# Altium schematic sheet 0188_PECI CONNECTIONS.SchDoc
size 848 x 558 mm
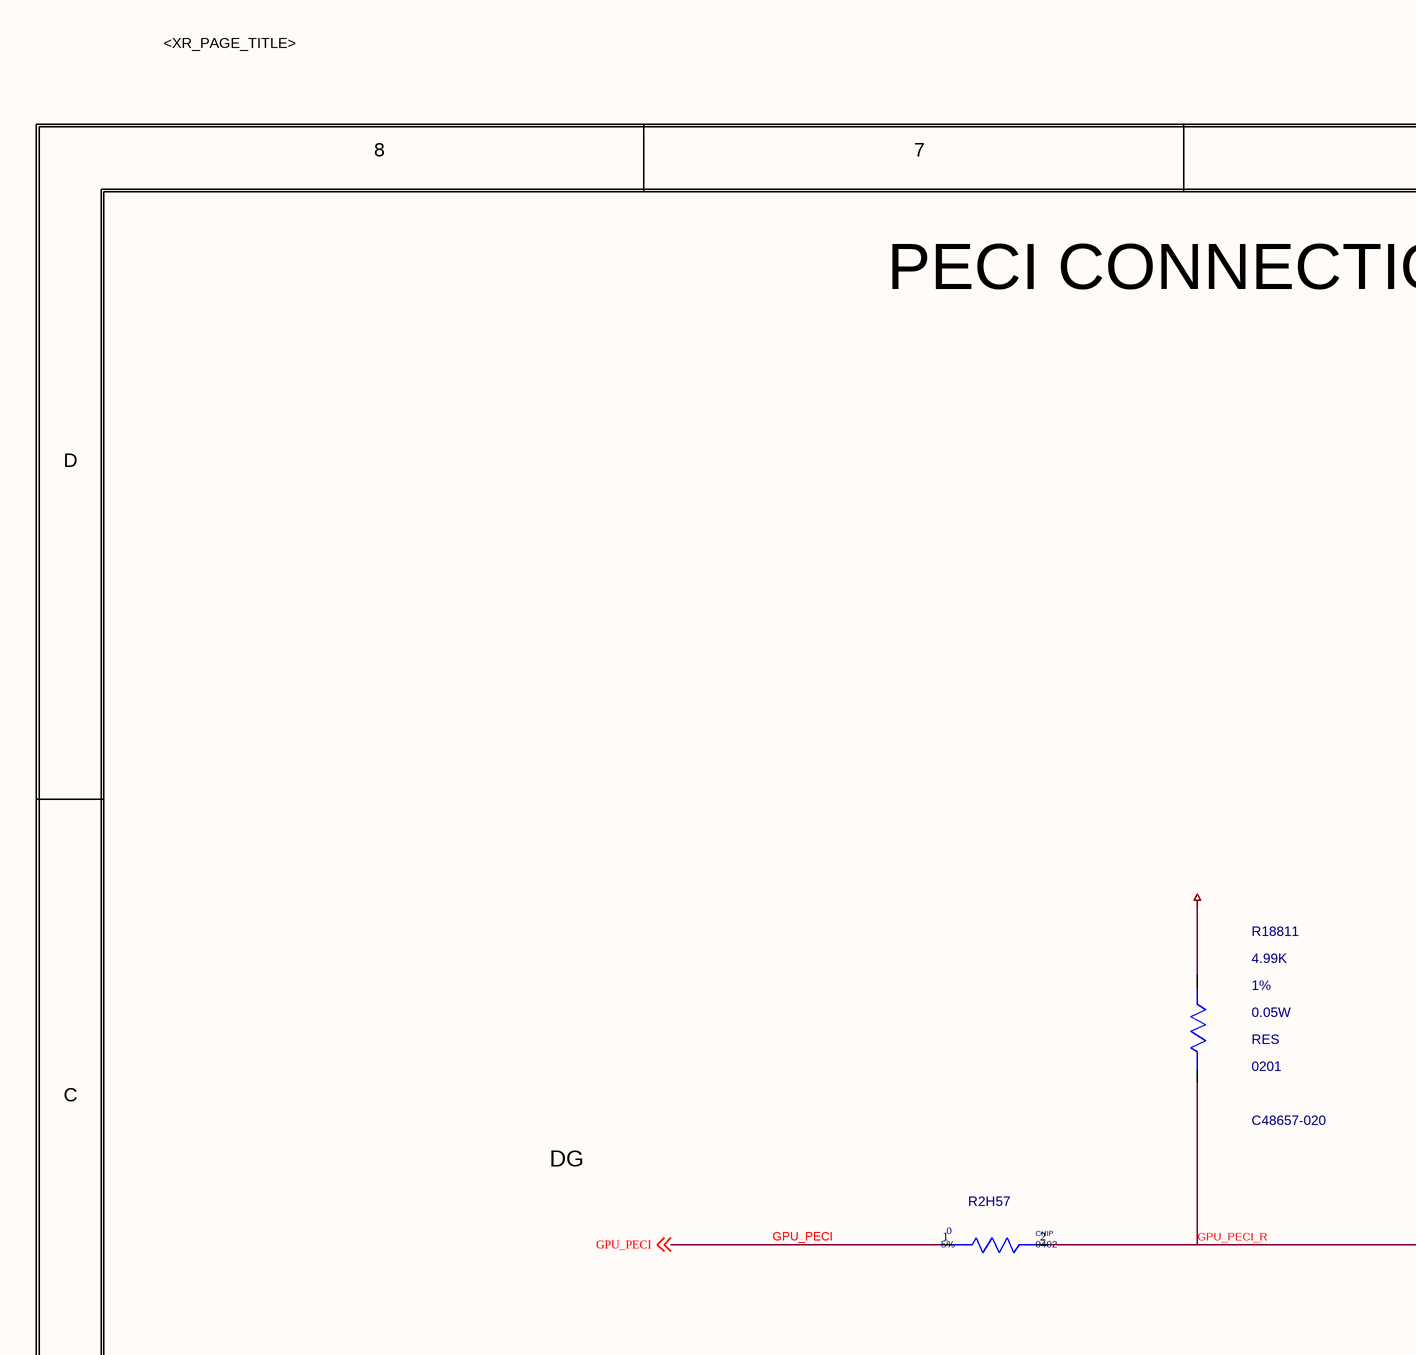
[diagram p0: 0188_PECI CONNECTIONS.SchDoc, top left]
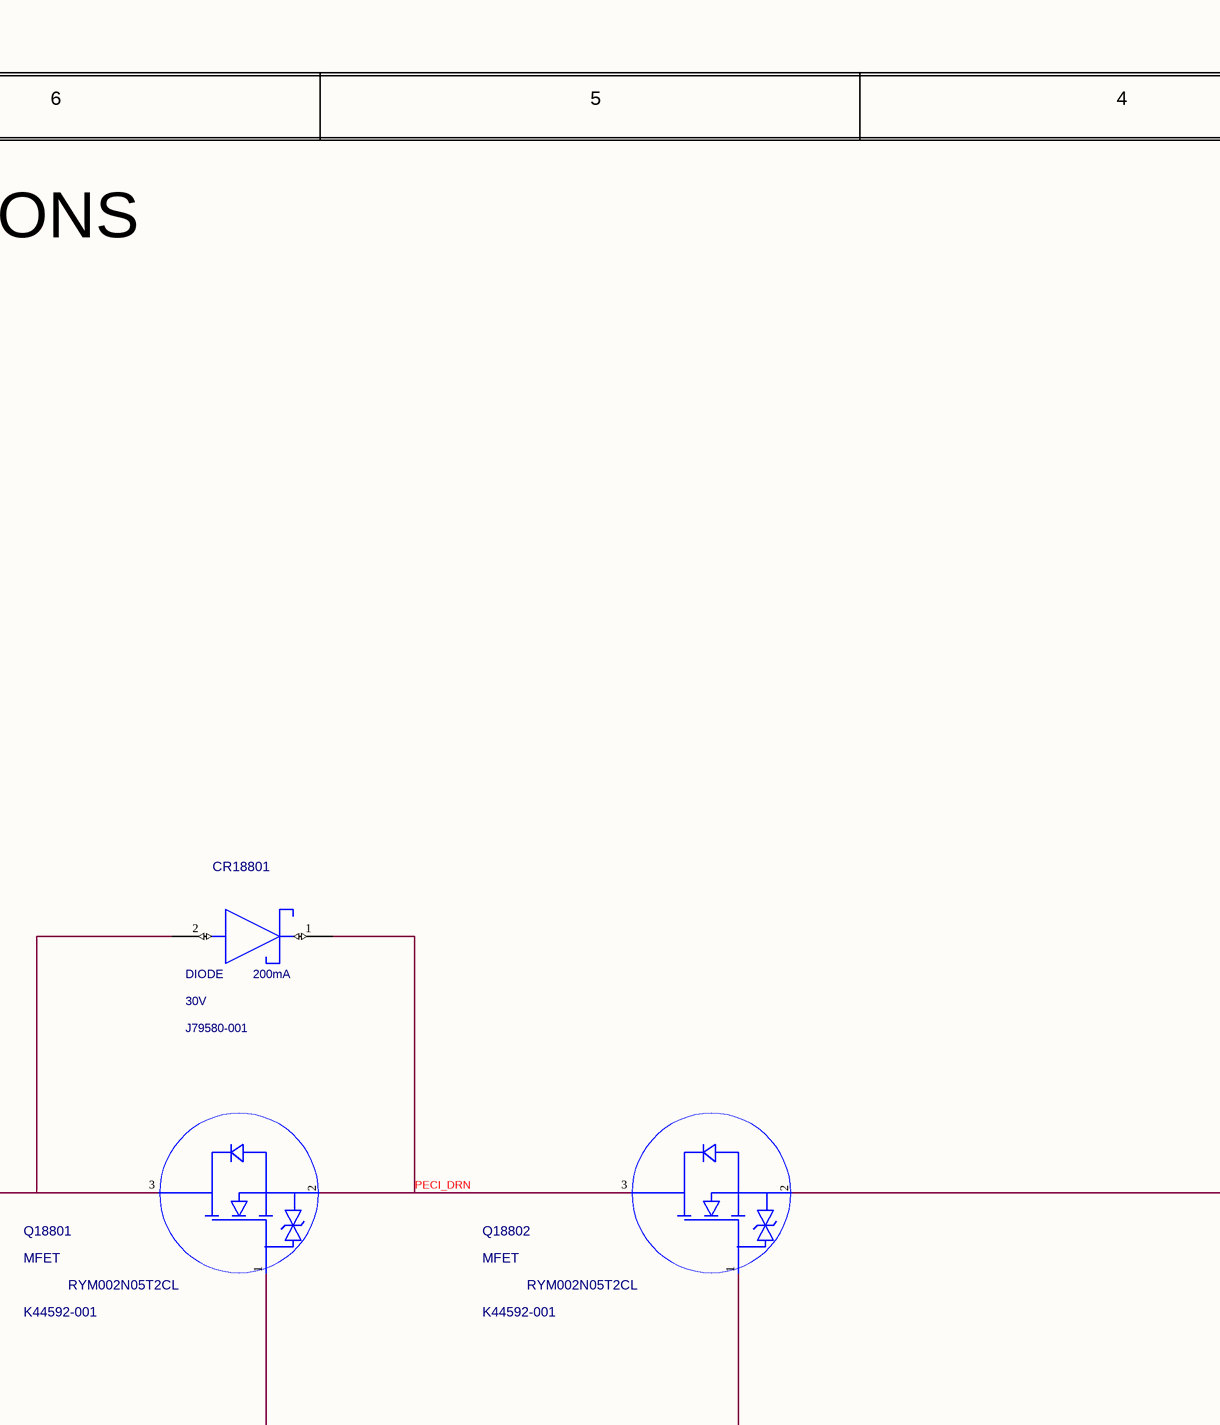
[diagram p1: 0188_PECI CONNECTIONS.SchDoc, top middle]
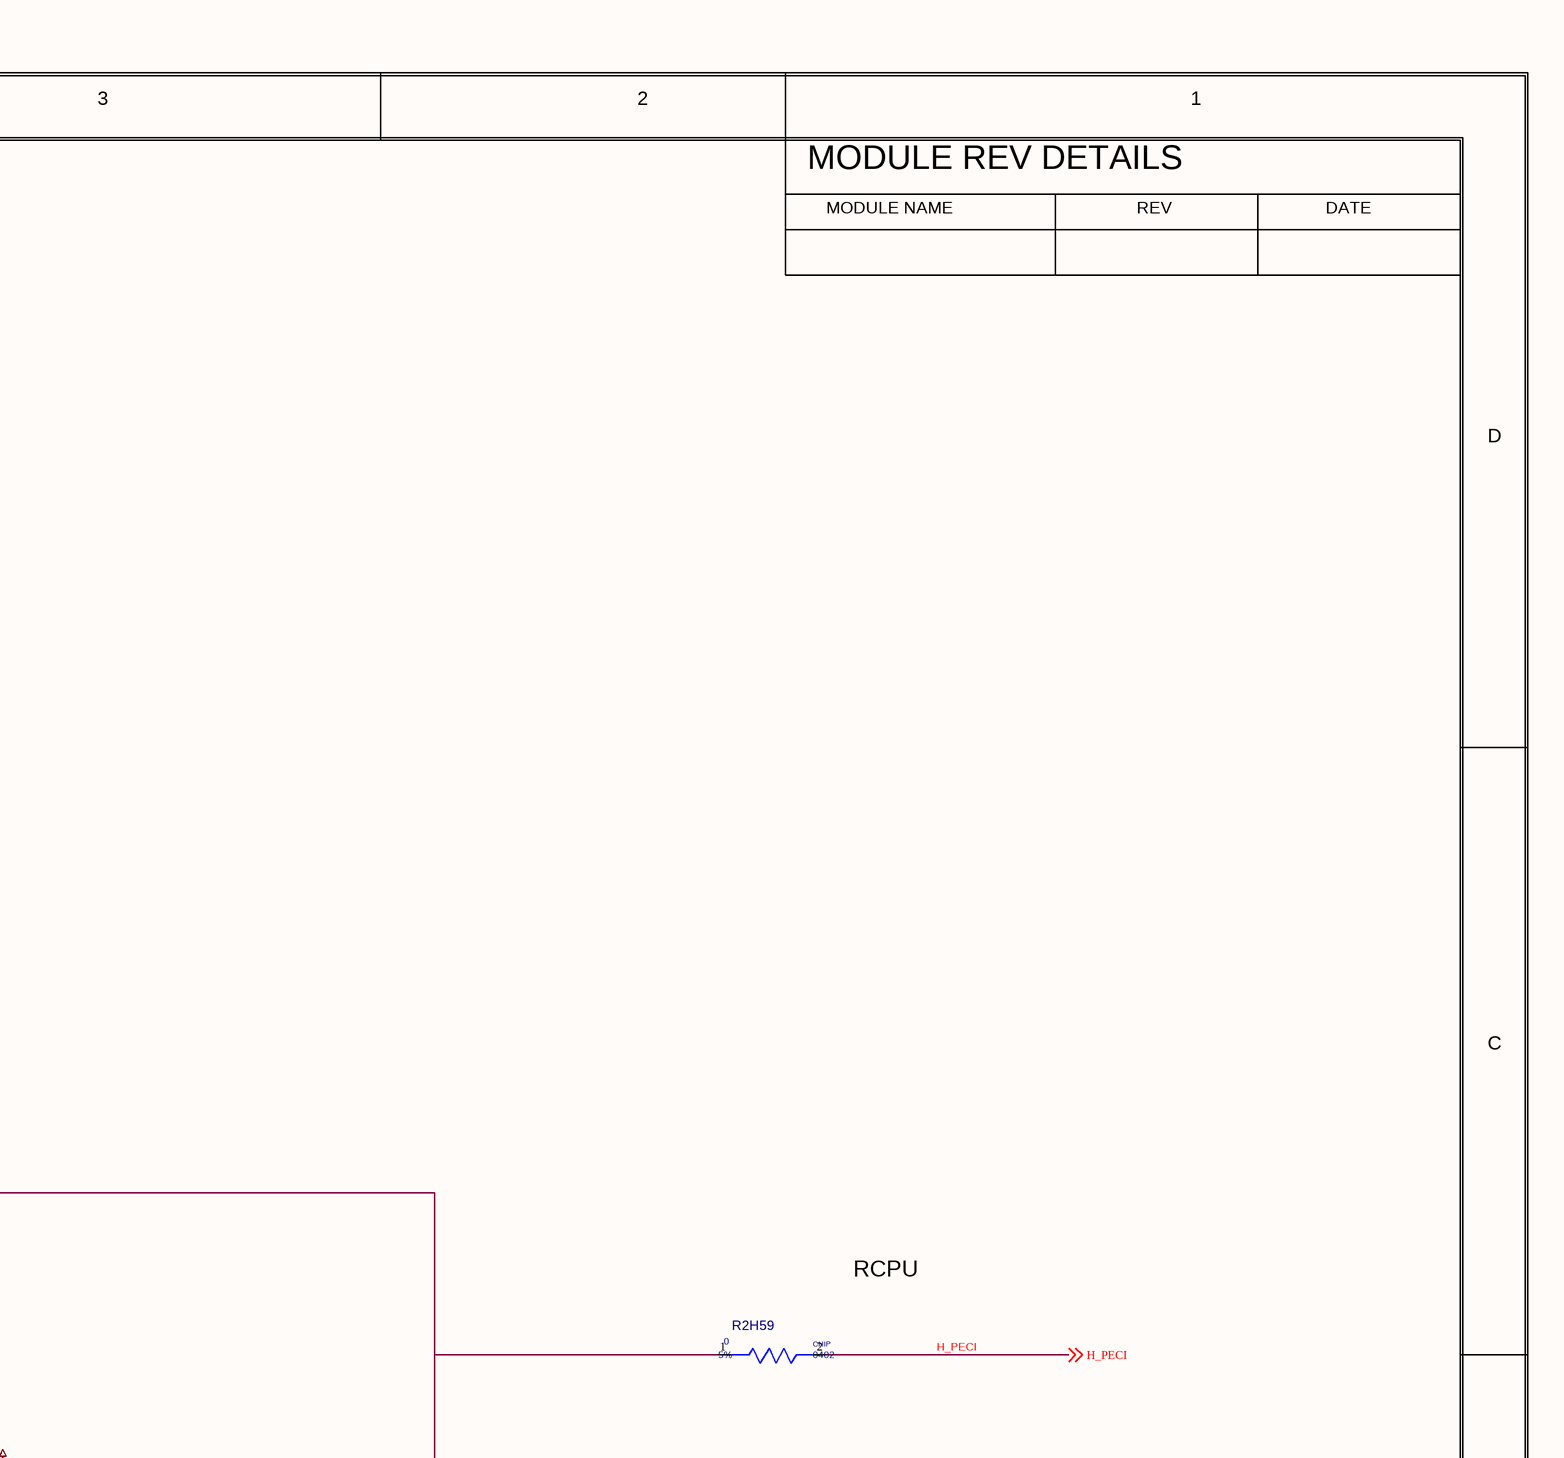
[diagram p2: 0188_PECI CONNECTIONS.SchDoc, top right]
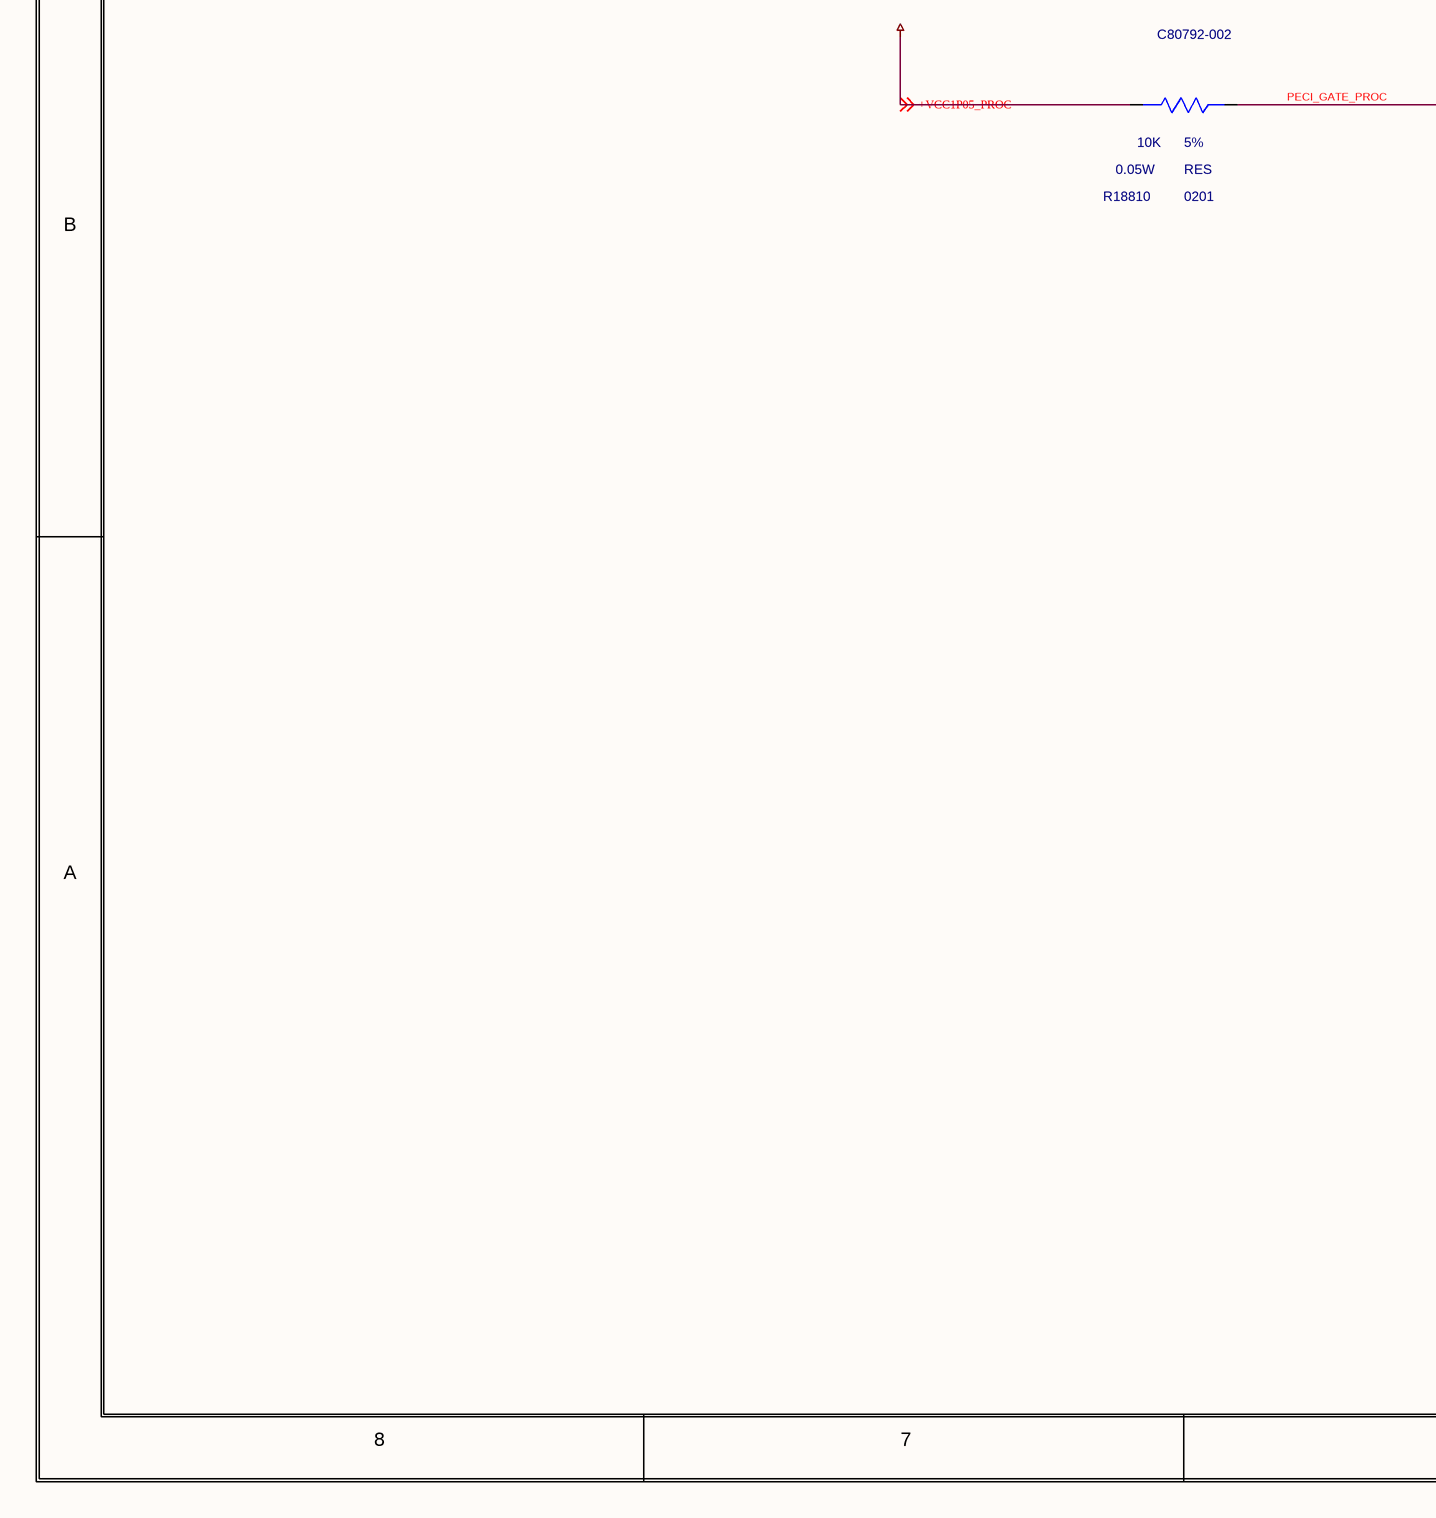
[diagram p3: 0188_PECI CONNECTIONS.SchDoc, bottom left]
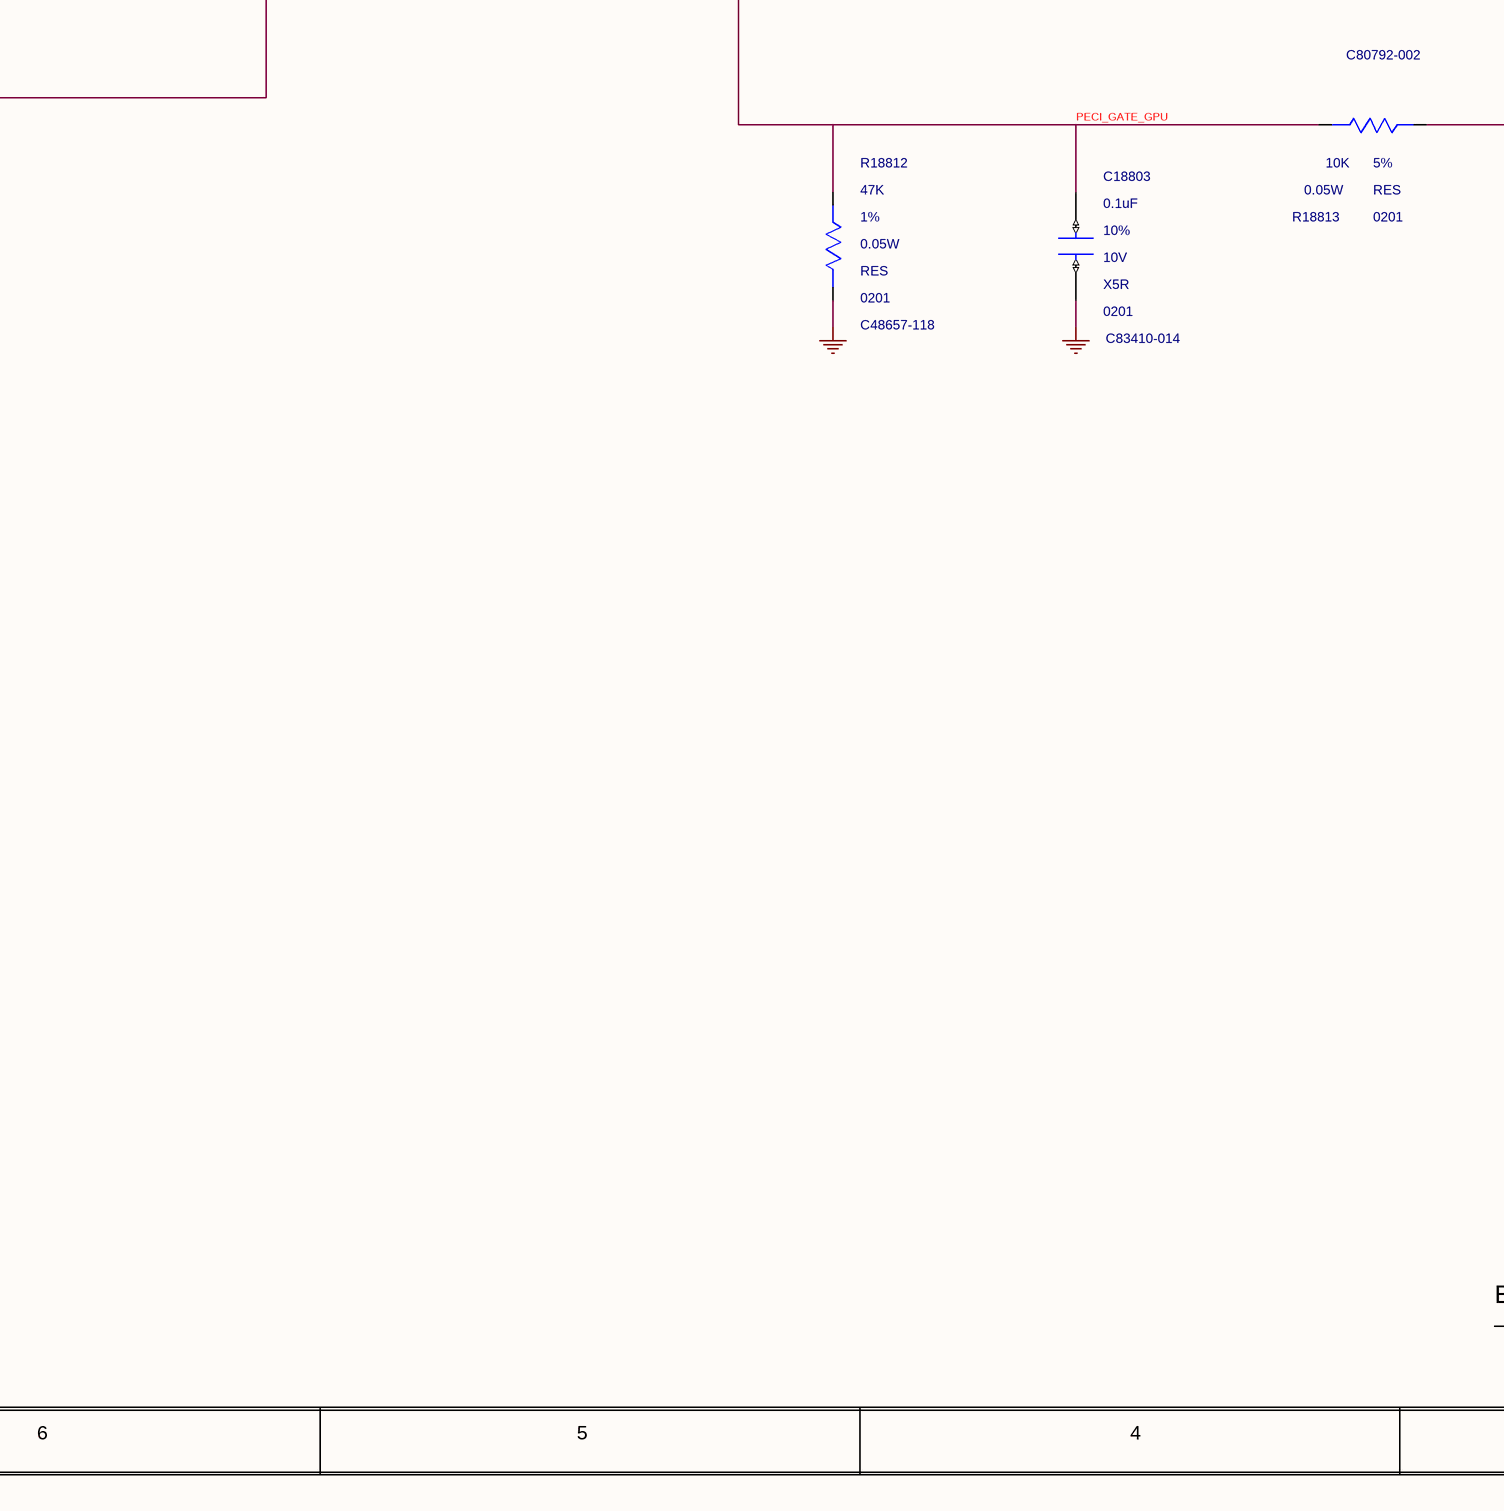
[diagram p4: 0188_PECI CONNECTIONS.SchDoc, bottom middle]
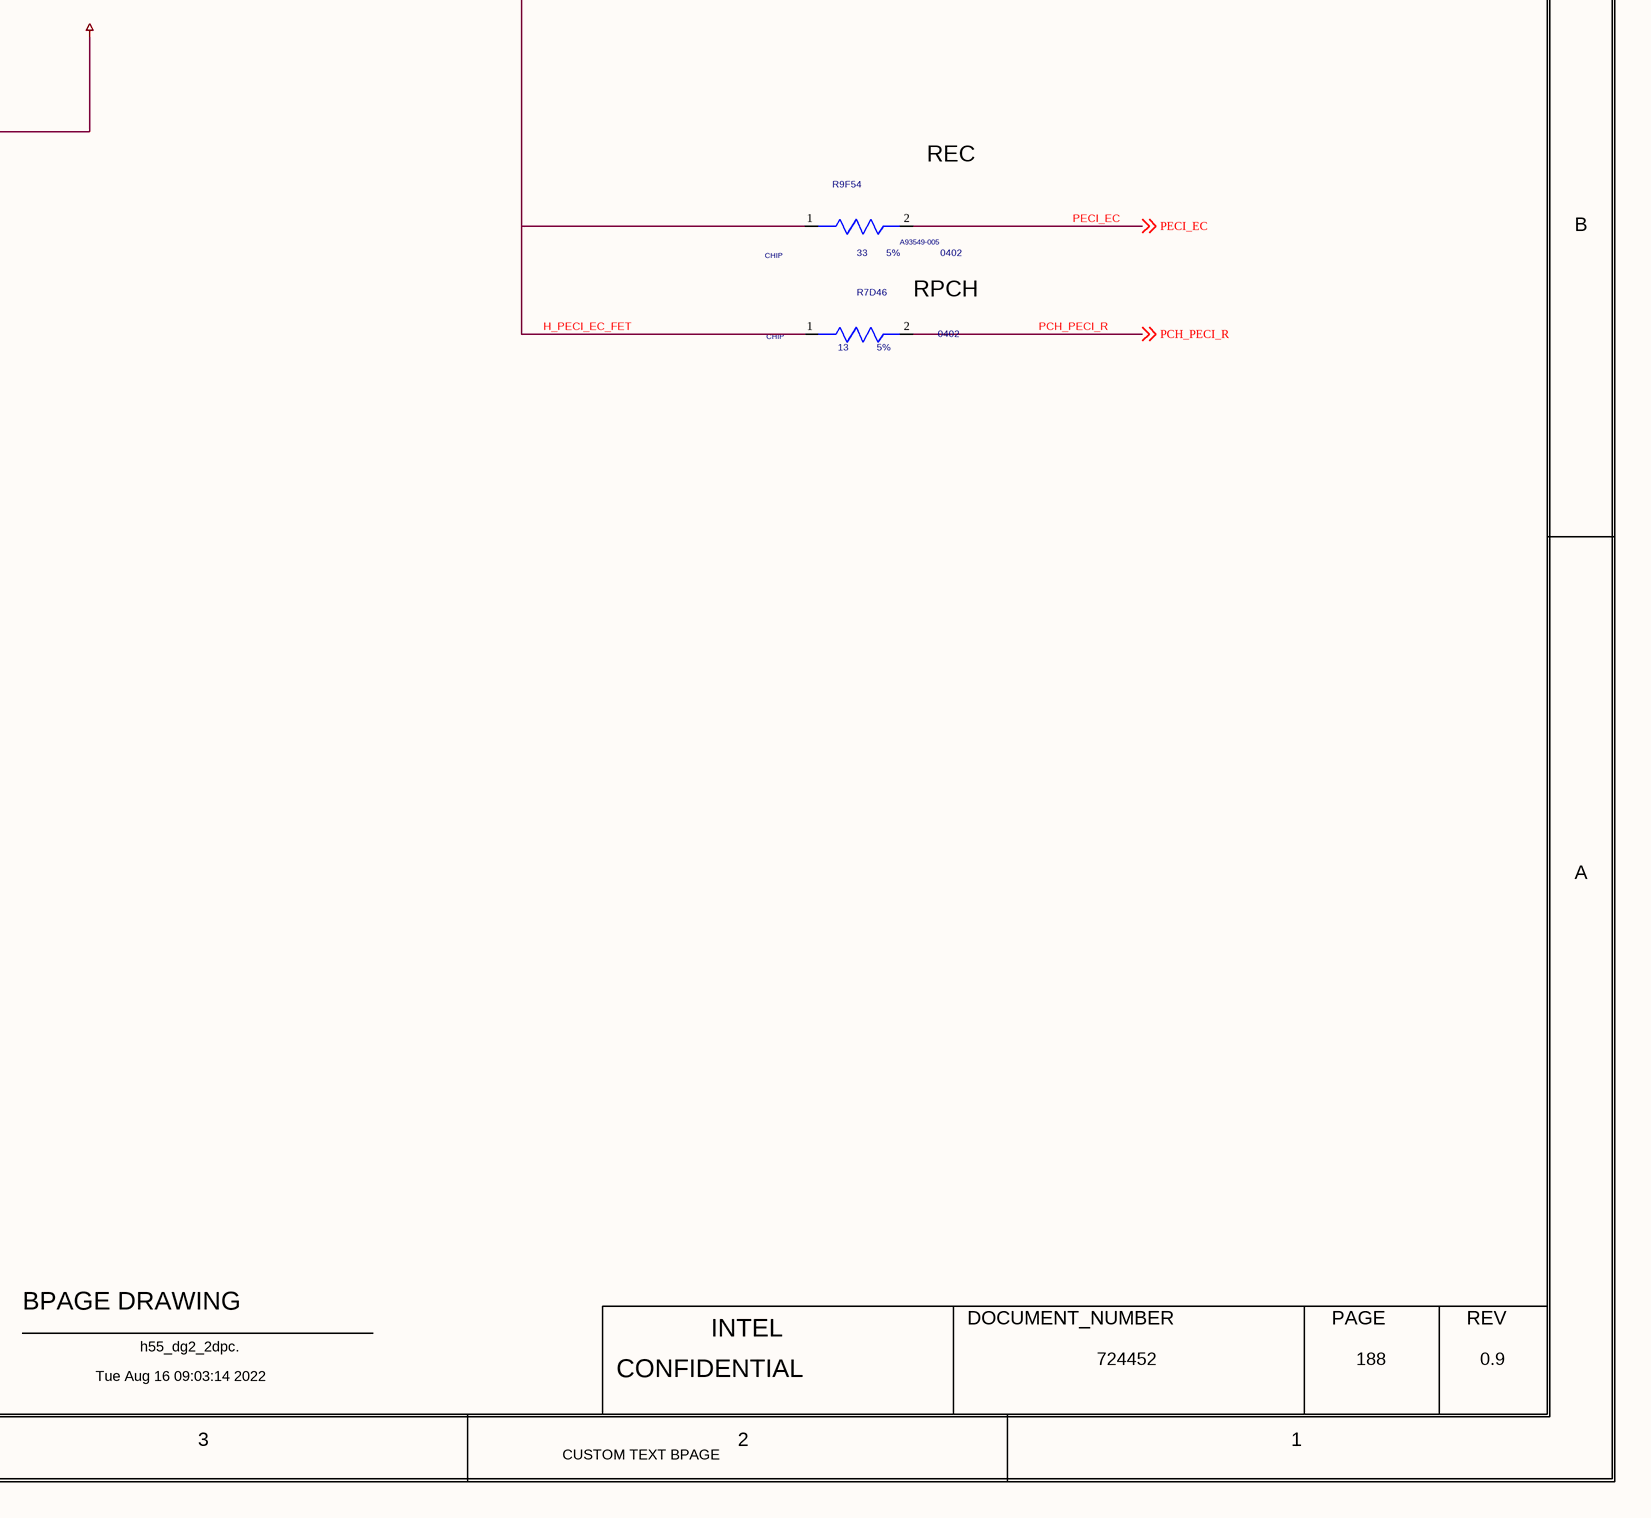
[diagram p5: 0188_PECI CONNECTIONS.SchDoc, bottom right]

## Parts
C18803  0.1uF  MATERIAL: X5R  PACK_TYPE: 0201  PART_NUMBER: C83410-014  TOLERANCE: 10%  VOLTAGE: 10V  [CTK2_SM0201_630X330_MA]
CR18801  30V  CURRENT: 200mA  MATERIAL: DIODE  PART_NUMBER: J79580-001  [SCR65X35MA]
Q18801  RYM002N05T2CL  MATERIAL: MFET  PART_NUMBER: K44592-001  [CTK2_SOT723_900X1300_400_MA]
Q18802  RYM002N05T2CL  MATERIAL: MFET  PART_NUMBER: K44592-001  [CTK2_SOT723_900X1300_400_MA]
R2H57  0  MATERIAL: CHIP  PACK_TYPE: 0402  TOLERANCE: 5%  [SMR0402IA]
R2H59  0  MATERIAL: CHIP  PACK_TYPE: 0402  TOLERANCE: 5%  [SMR0402IA]
R7D46  13  MATERIAL: CHIP  PACK_TYPE: 0402  TOLERANCE: 5%  [SMR0402IC]
R9F54  33  MATERIAL: CHIP  PACK_TYPE: 0402  PART_NUMBER: A93549-005  TOLERANCE: 5%  [SMR0402IA]
R18810  10K  MATERIAL: RES  PACK_TYPE: 0201  PART_NUMBER: C80792-002  TOLERANCE: 5%  WATTAGE: 0.05W  [CTK2_SM0201_630X330_MA]
R18811  4.99K  MATERIAL: RES  PACK_TYPE: 0201  PART_NUMBER: C48657-020  TOLERANCE: 1%  WATTAGE: 0.05W  [CTK2_SM0201_630X330_MA]
R18812  47K  MATERIAL: RES  PACK_TYPE: 0201  PART_NUMBER: C48657-118  TOLERANCE: 1%  WATTAGE: 0.05W  [CTK2_SM0201_630X330_MA]
R18813  10K  MATERIAL: RES  PACK_TYPE: 0201  PART_NUMBER: C80792-002  TOLERANCE: 5%  WATTAGE: 0.05W  [CTK2_SM0201_630X330_MA]

## Nets
+V1P8S_GPU: R18811.1(A) R18813.2(B)
+VCC1P05_PROC: R18810.1(A) ; off-sheet +VCC1P05_PROC
GND: C18803.2(B) R18812.2(B)
GPU_PECI: R2H57.1(A) ; off-sheet GPU_PECI
GPU_PECI_R: CR18801.2(ANODE) Q18801.3(D) R2H57.2(B) R18811.2(B)
H_PECI: R2H59.2(B) ; off-sheet H_PECI
H_PECI_EC_FET: Q18802.2(S) R2H59.1(A) R7D46.1(A) R9F54.1(A)
PCH_PECI_R: R7D46.2(B) ; off-sheet PCH_PECI_R
PECI_DRN: CR18801.1(CATHODE) Q18801.2(S) Q18802.3(D)
PECI_EC: R9F54.2(B) ; off-sheet PECI_EC
PECI_GATE_GPU: C18803.1(A) Q18802.1(G) R18812.1(A) R18813.1(A)
PECI_GATE_PROC: Q18801.1(G) R18810.2(B)

## Notes on the sheet
- <XR_PAGE_TITLE>
- 8
- 7
- 6
- 5
- 4
- 3
- 2
- 1
- MODULE REV DETAILS
- PECI CONNECTIONS
- MODULE NAME
- REV
- DATE
- D
- C
- DG
- RCPU
- REC
- B
- RPCH
- A
- BPAGE DRAWING
- INTEL
- DOCUMENT_NUMBER
- PAGE
- Tue Aug 16 09:03:14 2022
- h55_dg2_2dpc.
- CONFIDENTIAL
- 724452
- 188
- 0.9
- CUSTOM TEXT BPAGE

## Library data of the parts
C18803 = C_CAP: CDS_PHYS_PART_NAME: C_CAP_0201-C83410-014,X5R,0.1UF,10V,10%,TK2,GENERIC; CDS_LMAN_SYM_OUTLINE: -50,50,50,-50; FP_TECH: TK2; IP: GENERIC; ROOM: NONE; OriginalSymbolOrigin: (-50,25); XY: (-3600,2150); VER: 1; ROT: 0; PHYS_PAGE: 188; LOCATION: C18803; DRAWING: @RVP1_ADL_SB_ADP_S_DDR5_SODIMM_2DPC_LIB.H55_DG2_2DPC(SCH_1):PAGE557; CDS_LIB: c_discrete; VARIANT: ?; PCB Footprint: CTK2_SM0201_630X330_MA; CHIPS_PART_NAME: C_CAP; CDS_PART_NAME: C_CAP_0201-C83410-014,X5R,0.1UF,10V,10%,TK2,GENERIC; CDS_LOCATION: C18803
CR18801 = DIODE_SCHOTTKY: CDS_PHYS_PART_NAME: DIODE_SCHOTTKY_SM-J79580-001,DIODE,30V,200MA,LPDB,GENERIC; CDS_LMAN_SYM_OUTLINE: -50,100,50,-100; PACK_TYPE: SM; OriginalSymbolOrigin: (-75,50); XY: (-5125,3525); VER: 1; SUB_ROOM_2: MISC; SUB_ROOM_1: BOOT_FLASH_AP; ROT: 0; PHYS_PAGE: 188; LOCATION: CR18801; FP_TECH: LPDB; DRAWING: @RVP1_ADL_SB_ADP_S_DDR5_SODIMM_2DPC_LIB.H55_DG2_2DPC(SCH_1):PAGE557; CDS_LIB: discrete; PCB Footprint: SCR65X35MA; CHIPS_PART_NAME: DIODE_SCHOTTKY; CDS_PART_NAME: DIODE_SCHOTTKY_SM-J79580-001,DIODE,30V,200MA,LPDB,GENERIC; CDS_LOCATION: CR18801
Q18801 = C_MOSFET_N_ESD: CDS_PHYS_PART_NAME: C_MOSFET_N_ESD_SOT723-K44592-001,MFET,RYM002N05T2CL,TK2,GENERIC; CDS_LMAN_SYM_OUTLINE: -150,150,150,-150; FP_TECH: TK2; IP: GENERIC; PACK_TYPE: SOT723; ROOM: NONE; OriginalSymbolOrigin: (-150,150); XY: (-5150,3050); VER: 1; PHYS_PAGE: 188; LOCATION: Q18801; DRAWING: @RVP1_ADL_SB_ADP_S_DDR5_SODIMM_2DPC_LIB.H55_DG2_2DPC(SCH_1):PAGE557; CDS_LIB: local; VARIANT: ?; PCB Footprint: CTK2_SOT723_900X1300_400_MA; ROT: 1; CHIPS_PART_NAME: C_MOSFET_N_ESD; CDS_PART_NAME: C_MOSFET_N_ESD_SOT723-K44592-001,MFET,RYM002N05T2CL,TK2,GENERIC; CDS_LOCATION: Q18801
Q18802 = C_MOSFET_N_ESD: CDS_PHYS_PART_NAME: C_MOSFET_N_ESD_SOT723-K44592-001,MFET,RYM002N05T2CL,TK2,GENERIC; CDS_LMAN_SYM_OUTLINE: -150,150,150,-150; FP_TECH: TK2; IP: GENERIC; PACK_TYPE: SOT723; ROOM: NONE; OriginalSymbolOrigin: (-150,150); XY: (-4275,3050); VER: 1; PHYS_PAGE: 188; LOCATION: Q18802; DRAWING: @RVP1_ADL_SB_ADP_S_DDR5_SODIMM_2DPC_LIB.H55_DG2_2DPC(SCH_1):PAGE557; CDS_LIB: local; VARIANT: ?; PCB Footprint: CTK2_SOT723_900X1300_400_MA; ROT: 1; CHIPS_PART_NAME: C_MOSFET_N_ESD; CDS_PART_NAME: C_MOSFET_N_ESD_SOT723-K44592-001,MFET,RYM002N05T2CL,TK2,GENERIC; CDS_LOCATION: Q18802
R2H57 = RES#1: PART_NUMBER: A93549-001; CHIPS_PART_NAME: RES; CDS_PHYS_PART_NAME: RES_0402-A93549-001,CHIP,0,5%,1/16W,LPDB,GENERIC; WATTAGE: 1/16W; OriginalSymbolOrigin: (-75,25); XY: (-6350,3050); VER: 1; PHYS_PAGE: 188; LOCATION: R2H57; IP: GENERIC; FP_TECH: LPDB; DRAWING: @RVP1_ADL_SB_ADP_S_DDR5_SODIMM_2DPC_LIB.H55_DG2_2DPC(SCH_1):PAGE557; CDS_LIB: discrete; PCB Footprint: SMR0402IA; ROT: 0; CDS_PART_NAME: RES_0402-A93549-001,CHIP,0,5%,1/16W,LPDB,GENERIC; CDS_LOCATION: R2H57; ASI_MODEL: A93549-001
R2H59 = RES#1: PART_NUMBER: A93549-001; CHIPS_PART_NAME: RES; CDS_PHYS_PART_NAME: RES_0402-A93549-001,CHIP,0,5%,1/16W,LPDB,GENERIC; WATTAGE: 1/16W; OriginalSymbolOrigin: (-75,25); XY: (-1275,2750); VER: 1; PHYS_PAGE: 188; LOCATION: R2H59; IP: GENERIC; FP_TECH: LPDB; DRAWING: @RVP1_ADL_SB_ADP_S_DDR5_SODIMM_2DPC_LIB.H55_DG2_2DPC(SCH_1):PAGE557; CDS_LIB: discrete; PCB Footprint: SMR0402IA; ROT: 0; CDS_PART_NAME: RES_0402-A93549-001,CHIP,0,5%,1/16W,LPDB,GENERIC; CDS_LOCATION: R2H59; ASI_MODEL: A93549-001
R7D46 = RES#1: PART_NUMBER: A93549-068; CHIPS_PART_NAME: RES; CDS_PHYS_PART_NAME: RES_0402-A93549-068,CHIP,13,5%,1/16W,LPDB,GENERIC; WATTAGE: 1/16W; OriginalSymbolOrigin: (-75,25); XY: (-1275,2000); VER: 1; ROT: 0; PHYS_PAGE: 188; LOCATION: R7D46; IP: GENERIC; FP_TECH: LPDB; DRAWING: @RVP1_ADL_SB_ADP_S_DDR5_SODIMM_2DPC_LIB.H55_DG2_2DPC(SCH_1):PAGE557; CDS_LIB: discrete; PCB Footprint: SMR0402IC; SEC_TYPE: 0402; CDS_PART_NAME: RES_0402-A93549-068,CHIP,13,5%,1/16W,LPDB,GENERIC; CDS_LOCATION: R7D46; ASI_MODEL: A93549-068
R9F54 = RES#1: CHIPS_PART_NAME: RES; CDS_PHYS_PART_NAME: RES_0402-A93549-005,CHIP,33,5%,1/16W,LPDB,GENERIC; WATTAGE: 1/16W; OriginalSymbolOrigin: (-75,25); XY: (-1275,2200); VER: 1; ROT: 0; PHYS_PAGE: 188; LOCATION: R9F54; IP: GENERIC; FP_TECH: LPDB; DRAWING: @RVP1_ADL_SB_ADP_S_DDR5_SODIMM_2DPC_LIB.H55_DG2_2DPC(SCH_1):PAGE557; CDS_LIB: discrete; PCB Footprint: SMR0402IA; SEC_TYPE: 0402; CDS_PART_NAME: RES_0402-A93549-005,CHIP,33,5%,1/16W,LPDB,GENERIC; CDS_LOCATION: R9F54; ASI_MODEL: A93549-005
R18810 = C_RES#1: CHIPS_PART_NAME: C_RES; CDS_PHYS_PART_NAME: C_RES_0201-C80792-002,RES,10K,5%,0.05W,TK2,GENERIC; CDS_LMAN_SYM_OUTLINE: -50,50,50,-50; FP_TECH: TK2; IP: GENERIC; ROOM: NONE; OriginalSymbolOrigin: (-75,25); XY: (-6000,2425); VER: 1; ROT: 0; PHYS_PAGE: 188; LOCATION: R18810; DRAWING: @RVP1_ADL_SB_ADP_S_DDR5_SODIMM_2DPC_LIB.H55_DG2_2DPC(SCH_1):PAGE557; CDS_LIB: c_discrete; VARIANT: ?; PCB Footprint: CTK2_SM0201_630X330_MA; CDS_PART_NAME: C_RES_0201-C80792-002,RES,10K,5%,0.05W,TK2,GENERIC; CDS_LOCATION: R18810
R18811 = C_RES: CDS_PHYS_PART_NAME: C_RES_0201-C48657-020,RES,4.99K,1%,0.05W,TK2,GENERIC; CDS_LMAN_SYM_OUTLINE: -50,50,50,-50; FP_TECH: TK2; IP: GENERIC; ROOM: NONE; OriginalSymbolOrigin: (-25,75); XY: (-5975,3450); VER: 2; ROT: 0; PHYS_PAGE: 188; LOCATION: R18811; DRAWING: @RVP1_ADL_SB_ADP_S_DDR5_SODIMM_2DPC_LIB.H55_DG2_2DPC(SCH_1):PAGE557; CDS_LIB: c_discrete; VARIANT: ?; PCB Footprint: CTK2_SM0201_630X330_MA; CHIPS_PART_NAME: C_RES; CDS_PART_NAME: C_RES_0201-C48657-020,RES,4.99K,1%,0.05W,TK2,GENERIC; CDS_LOCATION: R18811
R18812 = C_RES: CDS_PHYS_PART_NAME: C_RES_0201-C48657-118,RES,47K,1%,0.05W,TK2,GENERIC; CDS_LMAN_SYM_OUTLINE: -50,50,50,-50; FP_TECH: TK2; IP: GENERIC; ROOM: NONE; OriginalSymbolOrigin: (-25,75); XY: (-4050,2150); VER: 2; ROT: 0; PHYS_PAGE: 188; LOCATION: R18812; DRAWING: @RVP1_ADL_SB_ADP_S_DDR5_SODIMM_2DPC_LIB.H55_DG2_2DPC(SCH_1):PAGE557; CDS_LIB: c_discrete; VARIANT: ?; PCB Footprint: CTK2_SM0201_630X330_MA; CHIPS_PART_NAME: C_RES; CDS_PART_NAME: C_RES_0201-C48657-118,RES,47K,1%,0.05W,TK2,GENERIC; CDS_LOCATION: R18812
R18813 = C_RES#1: CHIPS_PART_NAME: C_RES; CDS_PHYS_PART_NAME: C_RES_0201-C80792-002,RES,10K,5%,0.05W,TK2,GENERIC; CDS_LMAN_SYM_OUTLINE: -50,50,50,-50; FP_TECH: TK2; IP: GENERIC; ROOM: NONE; OriginalSymbolOrigin: (-75,25); XY: (-3050,2375); VER: 1; ROT: 0; PHYS_PAGE: 188; LOCATION: R18813; DRAWING: @RVP1_ADL_SB_ADP_S_DDR5_SODIMM_2DPC_LIB.H55_DG2_2DPC(SCH_1):PAGE557; CDS_LIB: c_discrete; VARIANT: ?; PCB Footprint: CTK2_SM0201_630X330_MA; CDS_PART_NAME: C_RES_0201-C80792-002,RES,10K,5%,0.05W,TK2,GENERIC; CDS_LOCATION: R18813